# Altium schematic sheet [10]MISC.SchDoc
size A4
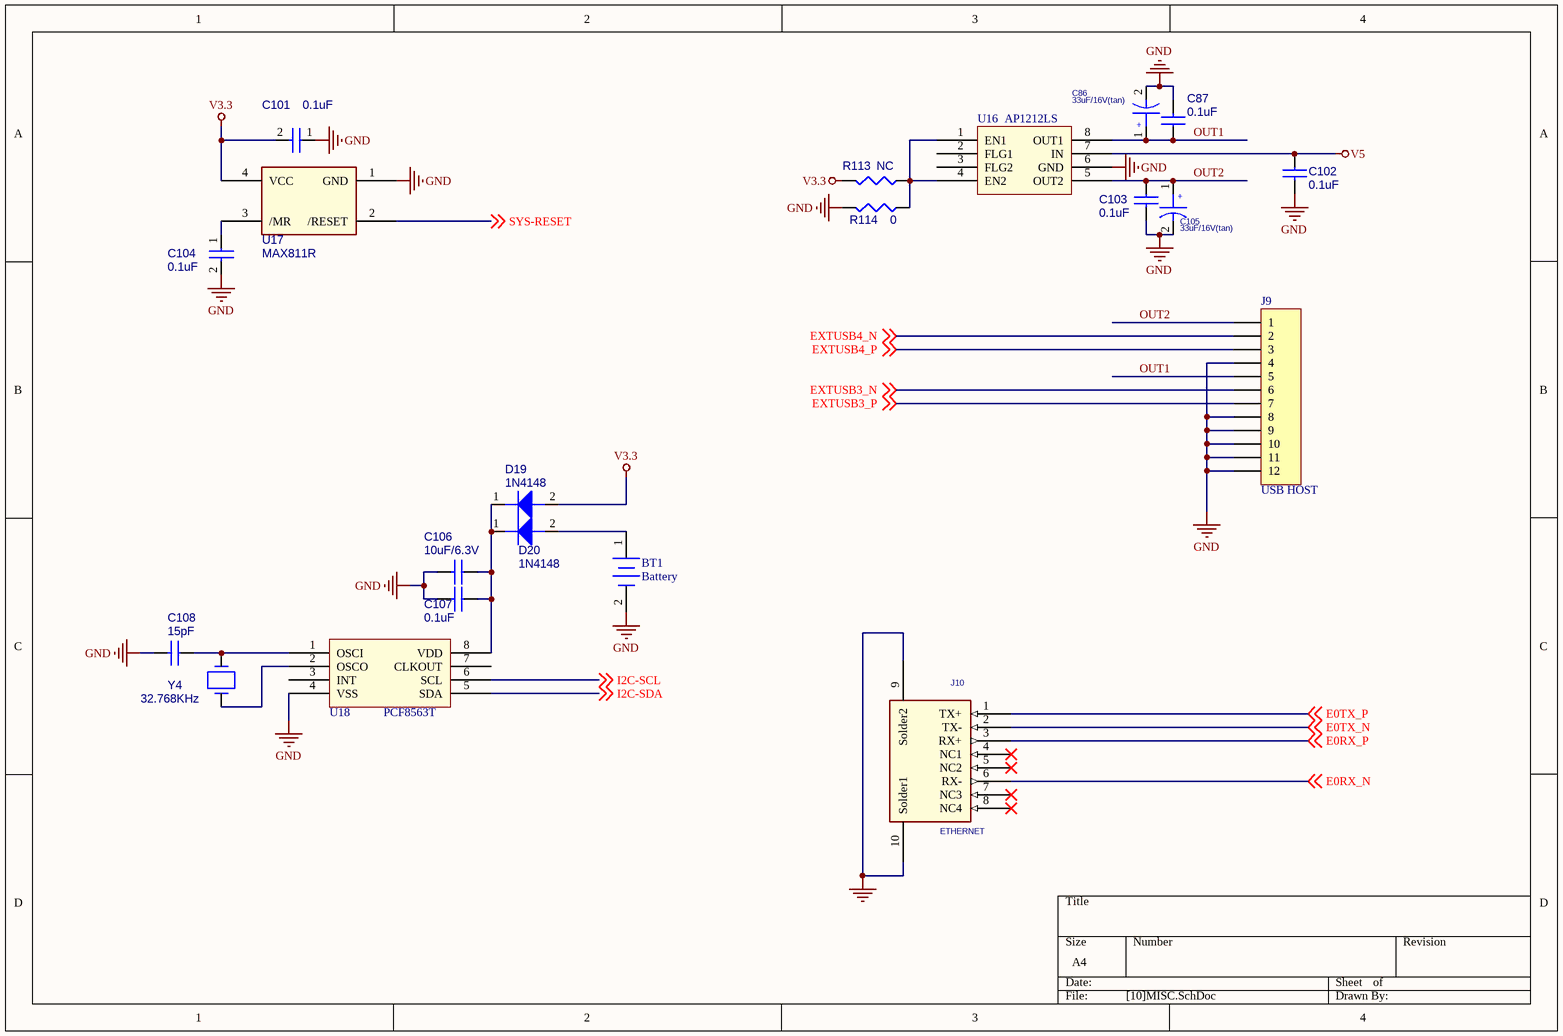
[diagram p0: [10]MISC.SchDoc]

## Parts
BT1  Battery  [CR1220]
C86  33uF/16V(tan)  [3528]
C87  0.1uF  [0603]
C101  0.1uF  [0603]
C102  0.1uF  [0603]
C103  0.1uF  [0603]
C104  0.1uF  [0603]
C105  33uF/16V(tan)  [3528]
C106  10uF/6.3V  [0805]
C107  0.1uF  [0603]
C108  15pF  [0603]
D19  1N4148  [MINI-MELF]
D20  1N4148  [MINI-MELF]
J9  USB HOST  [USB-HOST-2]
J10  ETHERNET  [RJ45]
R113  NC  [0603]
R114  0  [0603]
U16  AP1212LS  [SO8]
U17  MAX811R  [SOT143]
U18  PCF8563T  [SO8]
Y4  32.768KHz  [XTAL]

## Nets
GND: BT1.2(-) C86.2 C87.2 C101.1 C102.2 C103.2 C104.2 C105.2 C106.2 C107.2 C108.2 J9.4 J9.8 J9.9 J9.10 J9.11 J9.12 J10.9(Solder2) J10.10(Solder1) R114.2 U16.6(GND) U17.1(GND) U18.4(VSS)
V3.3: C101.2 D19.2 R113.2 U17.4(VCC)
V5: C102.1 U16.7(IN)
E0RX_N: J10.6(RX-) ; off-sheet E0RX_N
E0RX_P: J10.3(RX+) ; off-sheet E0RX_P
E0TX_N: J10.2(TX-) ; off-sheet E0TX_N
E0TX_P: J10.1(TX+) ; off-sheet E0TX_P
EXTUSB3_N: J9.6 ; off-sheet EXTUSB3_N
EXTUSB3_P: J9.7 ; off-sheet EXTUSB3_P
EXTUSB4_N: J9.2 ; off-sheet EXTUSB4_N
EXTUSB4_P: J9.3 ; off-sheet EXTUSB4_P
I2C-SCL: U18.6(SCL) ; off-sheet I2C-SCL
I2C-SDA: U18.5(SDA) ; off-sheet I2C-SDA
OUT1: C86.1 C87.1 J9.5 U16.8(OUT1)
OUT2: C103.1 C105.1 J9.1 U16.5(OUT2)
SYS-RESET: U17.2(/RESET) ; off-sheet SYS-RESET
NetBT1_1: BT1.1(+) D20.2
NetC104_1: C104.1 U17.3(/MR)
NetC106_1: C106.1 C107.1 D19.1 D20.1 U18.8(VDD)
NetC108_1: C108.1 U18.1(OSCI) Y4.2
NetR113_1: R113.1 R114.1 U16.1(EN1) U16.4(EN2)
NetU18_2: U18.2(OSCO) Y4.1

Not connected (* = marked no-connect by the designer): J10 4(NC1)* 5(NC2)* 7(NC3)* 8(NC4)*; U16 2(FLG1) 3(FLG2); U18 3(INT) 7(CLKOUT)

## Notes on the sheet
- (in symbol CAP WP) +

## Library data of the parts
BT1 = Battery: Multicell Battery
C86 C105 = CAP WP
C87 C102 C103 C106-C108 = CAP_Dup1
C101 C104 = CAP NP_Dup2
D19 D20 = 1N4148WS-7-F_SOD323-2
J9 = Header 12: Header, 12-Pin; LatestRevisionDate: 17-Jul-2002; LatestRevisionNote: Re-released for DXP Platform.; Publisher: Altium Limited
J10 = NET
R113 = R: Part Number: SD02810028L; Part Description: S RES 1/16W 10K +-5% 0402; Manufacturer Part number: null; Ecology: YES; Function Field: 32.3; Deletion Flag: 0; ROOM: SD; Lead Free: Y1; AP: AP; AP Sheet: http://ISPDPRD/Windchill/servlet/WindchillAuthGW/wt.enterprise.URLProcessor/URLTemplateAction?u8&oid=VR%3Aext.compal.part.Comp; Part Type: RESISTOR
R114 = R: Part Number: SD02810028L; Part Description: S RES 1/16W 10K +-5% 0402; Manufacturer Part number: null; Ecology: YES; Function Field: 32.3; ROOM: SD; Lead Free: Y1; AP: AP; AP Sheet: http://ISPDPRD/Windchill/servlet/WindchillAuthGW/wt.enterprise.URLProcessor/URLTemplateAction?u8&oid=VR%3Aext.compal.part.Comp; Part Type: RESISTOR; Deletion Flag: 0
U16 = AP1212
U17 = MAX811
Y4 = CRYSTAL